# EAGLE schematic encoder (EAGLE 7.4.0)
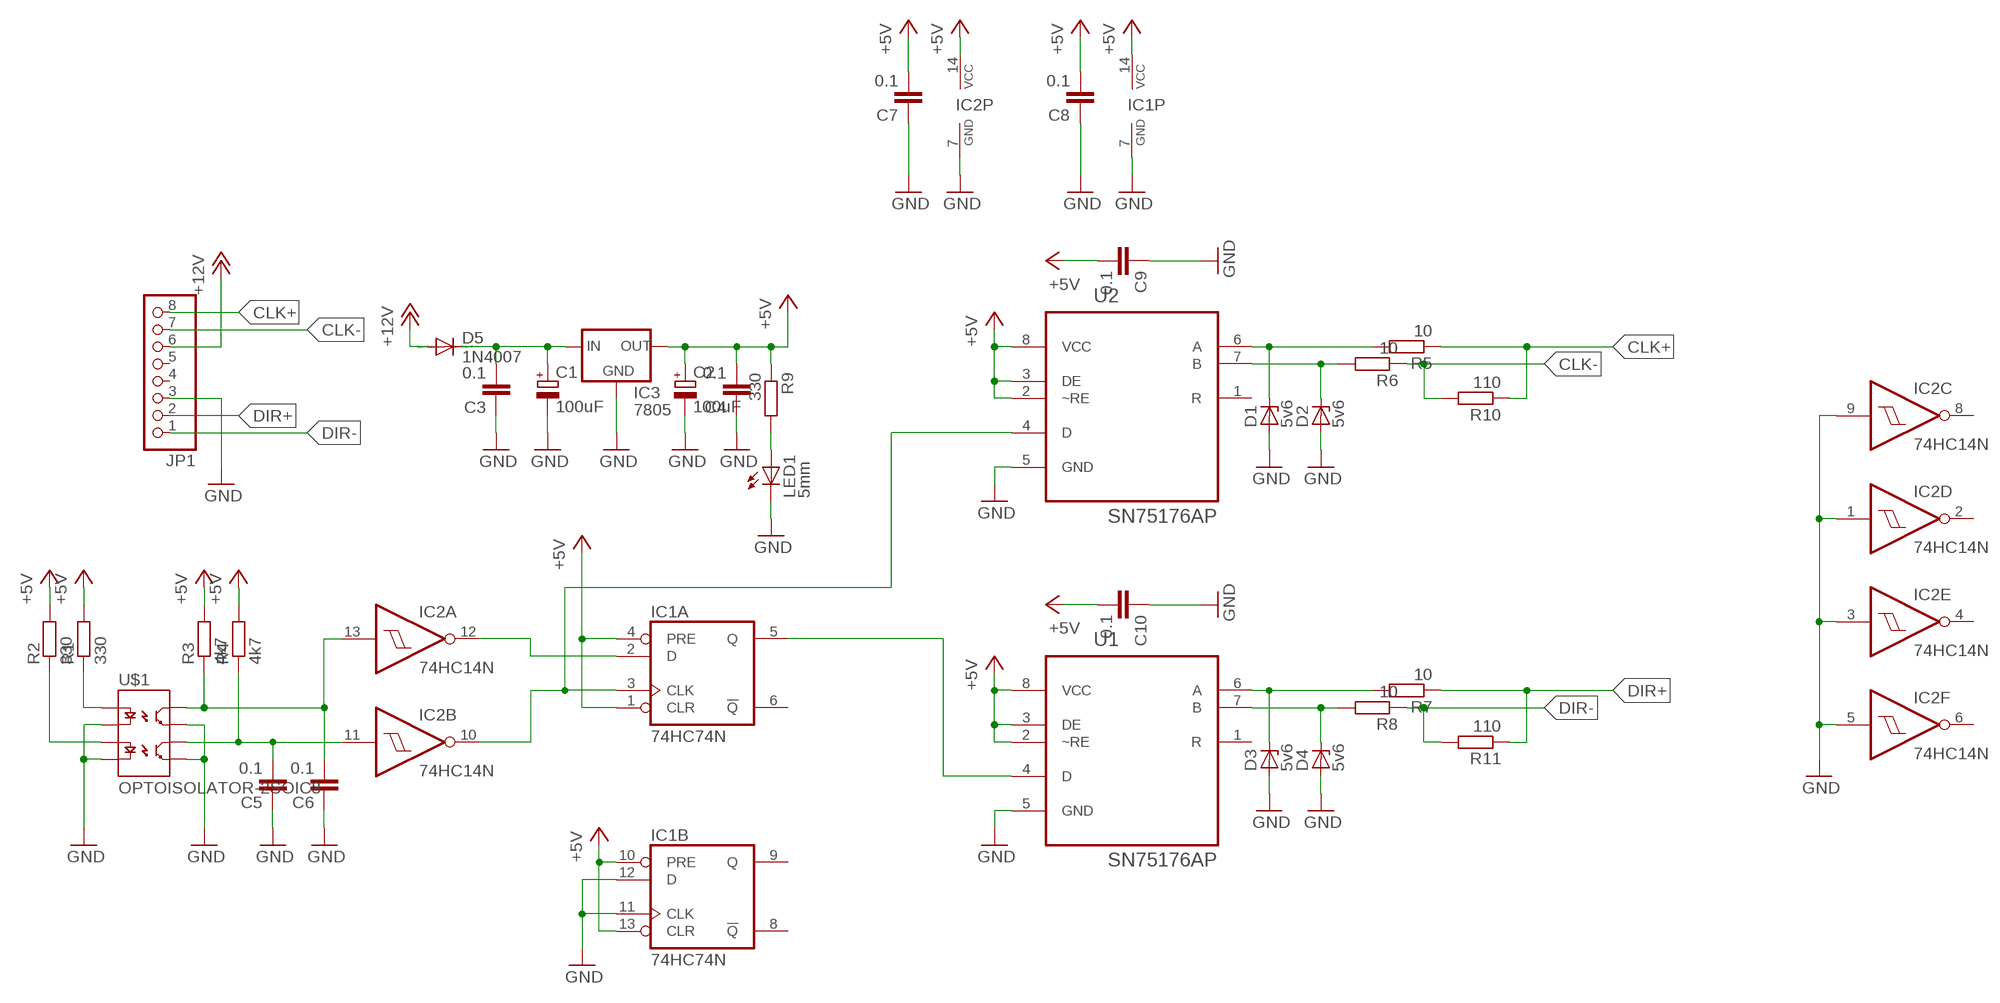
[diagram p0: schematic, sheet 1]

## Parts
C1  100uF  CPOL-EUE3.5-8  [E3,5-8]
C2  100uF  CPOL-EUE3.5-8  [E3,5-8]
C3  0.1  C-EU050-025X075  [C050-025X075]
C4  0.1  C-EU050-025X075  [C050-025X075]
C5  0.1  C-EU050-025X075  [C050-025X075]
C6  0.1  C-EU050-025X075  [C050-025X075]
C7  0.1  C-EU050-025X075  [C050-025X075]
C8  0.1  C-EU050-025X075  [C050-025X075]
C9  0.1  C-EU050-025X075  [C050-025X075]
C10  0.1  C-EU050-025X075  [C050-025X075]
D1  5v6  ZENER-DIODEZD-7.5  [ZDIO-7.5]
D2  5v6  ZENER-DIODEZD-7.5  [ZDIO-7.5]
D3  5v6  ZENER-DIODEZD-7.5  [ZDIO-7.5]
D4  5v6  ZENER-DIODEZD-7.5  [ZDIO-7.5]
D5  1N4007  DIODE-DO41-7.6  [DO41-7.6]
IC1  74HC74N  74AC74N  [DIL14]
IC2  74HC14N  74AC14N  [DIL14]
IC3  7805  78XXS  [78XXS]
JP1  PINHD-1X8  [1X08]
LED1  5mm  LED5MM  [LED5MM]
R1  330  R-EU_0204/7  [0204/7]
R2  330  R-EU_0204/7  [0204/7]
R3  4k7  R-EU_0204/7  [0204/7]
R4  4k7  R-EU_0204/7  [0204/7]
R5  10  R-EU_0204/7  [0204/7]
R6  10  R-EU_0204/7  [0204/7]
R7  10  R-EU_0204/7  [0204/7]
R8  10  R-EU_0204/7  [0204/7]
R9  330  R-EU_0204/7  [0204/7]
R10  110  R-EU_0204/7  [0204/7]
R11  110  R-EU_0204/7  [0204/7]
U1  SN75176AP  [DIP254P762X508-8]
U2  SN75176AP  [DIP254P762X508-8]
U$1  OPTOISOLATOR-2SOIC8  [SO08-2]

## Nets
+5V: C2.+ C4.2 C7.2 C8.2 C9.2 C10.2 IC1.1(A:CLR) IC1.4(A:PRE) IC1.10(B:PRE) IC1.13(B:CLR) IC1.14(P:VCC) IC2.14(P:VCC) IC3.OUT R1.2 R2.2 R3.2 R4.2 R9.1 U1.2(~RE) U1.3(DE) U1.8(VCC) U2.2(~RE) U2.3(DE) U2.8(VCC)
+12V: D5.A JP1.6
CLK+: JP1.8 R5.1 R10.1
CLK-: JP1.7 R6.1 R10.2
DIR+: JP1.2 R7.1 R11.1
DIR-: JP1.1 R8.1 R11.2
GND: C1.- C2.- C3.1 C4.1 C5.1 C6.1 C7.1 C8.1 C9.1 C10.1 D1.A D2.A D3.A D4.A IC1.7(P:GND) IC1.11(B:CLK) IC1.12(B:D) IC2.1(D:I) IC2.3(E:I) IC2.5(F:I) IC2.7(P:GND) IC2.9(C:I) IC3.GND JP1.3 LED1.K(C) U1.5(GND) U2.5(GND) U$1.2(C1) U$1.4(C2) U$1.5(EM2) U$1.7(EM1)
N$1: R1.1 U$1.1(A1)
N$2: R2.1 U$1.3(A2)
N$3: C6.2 IC2.13(A:I) R3.1 U$1.8(CL1)
N$4: C5.2 IC2.11(B:I) R4.1 U$1.6(CL2)
N$5: C1.+ C3.2 D5.C IC3.IN
N$6: IC1.3(A:CLK) IC2.10(B:O) U2.4(D)
N$7: IC1.5(A:Q) U1.4(D)
N$8: D1.C R5.2 U2.6(A)
N$9: D2.C R6.2 U2.7(B)
N$10: LED1.A R9.2
N$11: IC1.2(A:D) IC2.12(A:O)
N$12: D3.C R7.2 U1.6(A)
N$13: D4.C R8.2 U1.7(B)
Unconnected: IC1.6(A:!Q) IC1.8(B:!Q) IC1.9(B:Q) IC2.2(D:O) IC2.4(E:O) IC2.6(F:O) IC2.8(C:O) JP1.4 JP1.5 U1.1(R) U2.1(R)

## Library data of the parts
C1 C2 = rcl:CPOL-EU: POLARIZED CAPACITOR, European symbol
C3-C10 = rcl:C-EU: CAPACITOR, European symbol
D1-D4 = diode:ZENER-DIODE: Z-Diode
D5 = diode:DIODE-: DIODE
IC1 = 74xx-eu:74*74: Dual D type positive edge triggered FLIP FLOP, preset and clear
IC2 = 74xx-eu:74*14: Hex schmitt trigger INVERTER
IC3 = v-reg:78XXS: VOLTAGE REGULATOR
JP1 = pinhead:PINHD-1X8: PIN HEADER
LED1 = led:LED: LED OSRAM: - CHIPLED LG R971, LG N971, LY N971, LG Q971, LY Q971, LO R971, LY R971 LH N974, LH R974 LS Q976, LO Q976, LY Q976 LO Q996 - Hyper CHIPLED LW Q18S LB Q993, LB Q99A, LB R99A - SideLED LS A670, LO A670, LY A670, LG A670, LP A670 LB A673, LV A673, LT A673, LW A673 LH A674 LY A675 LS A676, LA A676, LO A676, LY A676, LW A676 LS A679, LY A679, LG A679 - Hyper Micro SIDELED® LS Y876, LA Y876, LO Y876, LY Y876 LT Y87S - SmartLED LW L88C, LW L88S LB L89C, LB L89S, LG L890 LS L89K, LO L89K, LY L89K LS L896, LA L896, LO L896, LY L896 - TOPLED LS T670, LO T670, LY T670, LG T670, LP T670 LSG T670, LSP T670, LSY T670, LOP T670, LYG T670 LG T671, LOG T671, LSG T671 LB T673, LV T673, LT T673, LW T673 LH T674 LS T676, LA T676, LO T676, LY T676, LB T676, LH T676, LSB T676, LW T676 LB T67C, LV T67C, LT T67C, LS T67K, LO T67K, LY T67K, LW E67C LS E67B, LA E67B, LO E67B, LY E67B, LB E67C, LV E67C, LT E67C LW T67C LS T679, LY T679, LG T679 LS T770, LO T770, LY T770, LG T770, LP T770 LB T773, LV T773, LT T773, LW T773 LH T774 LS E675, LA E675, LY E675, LS T675 LS T776, LA T776, LO T776, LY T776, LB T776 LHGB T686 LT T68C, LB T68C - Hyper Mini TOPLED® LB M676 - Mini TOPLED Santana® LG M470 LS M47K, LO M47K, LY M47K Source: http://www.osram.convergy.de LUXEON: - LUMILED® LXK2-PW12-R00, LXK2-PW12-S00, LXK2-PW14-U00, LXK2-PW14-V00 LXK2-PM12-R00, LXK2-PM12-S00, LXK2-PM14-U00 LXK2-PE12-Q00, LXK2-PE12-R00, LXK2-PE12-S00, LXK2-PE14-T00, LXK2-PE14-U00 LXK2-PB12-K00, LXK2-PB12-L00, LXK2-PB12-M00, LXK2-PB14-N00, LXK2-PB14-P00, LXK2-PB14-Q00 LXK2-PR12-L00, LXK2-PR12-M00, LXK2-PR14-Q00, LXK2-PR14-R00 LXK2-PD12-Q00, LXK2-PD12-R00, LXK2-PD12-S00 LXK2-PH12-R00, LXK2-PH12-S00 LXK2-PL12-P00, LXK2-PL12-Q00, LXK2-PL12-R00 Source: www.luxeon.com KINGBRIGHT: KA-3528ASYC Source: www.kingbright.com
R1-R11 = rcl:R-EU_: RESISTOR, European symbol
U1 U2 = Texas Instruments_By_element14_Batch_1:SN75176AP: DIFFERENTIAL BUS TRANSCEIVERS; MPN: SN75176AP; OC_FARNELL: 1103022; OC_NEWARK: 08F8125; PACKAGE: PDIP; SUPPLIER: Texas Instruments
U$1 = SparkFun-DiscreteSemi:OPTOISOLATOR-2: Description: Dual gate opto isolator. Vishay part : ILD213T; PROD_ID: IC-09076